# EasyEDA schematic 1-Schematic_CessnaCitationX_AP_Front.json

## Sheets
1 PCB_AP_FRONT_LEFT: TITLE: Left part of the AP font panel; REV: 1.0; Date: 2019-03-27; Sheet: 1/1; Drawn By: F-ORKI; Company: Your Company
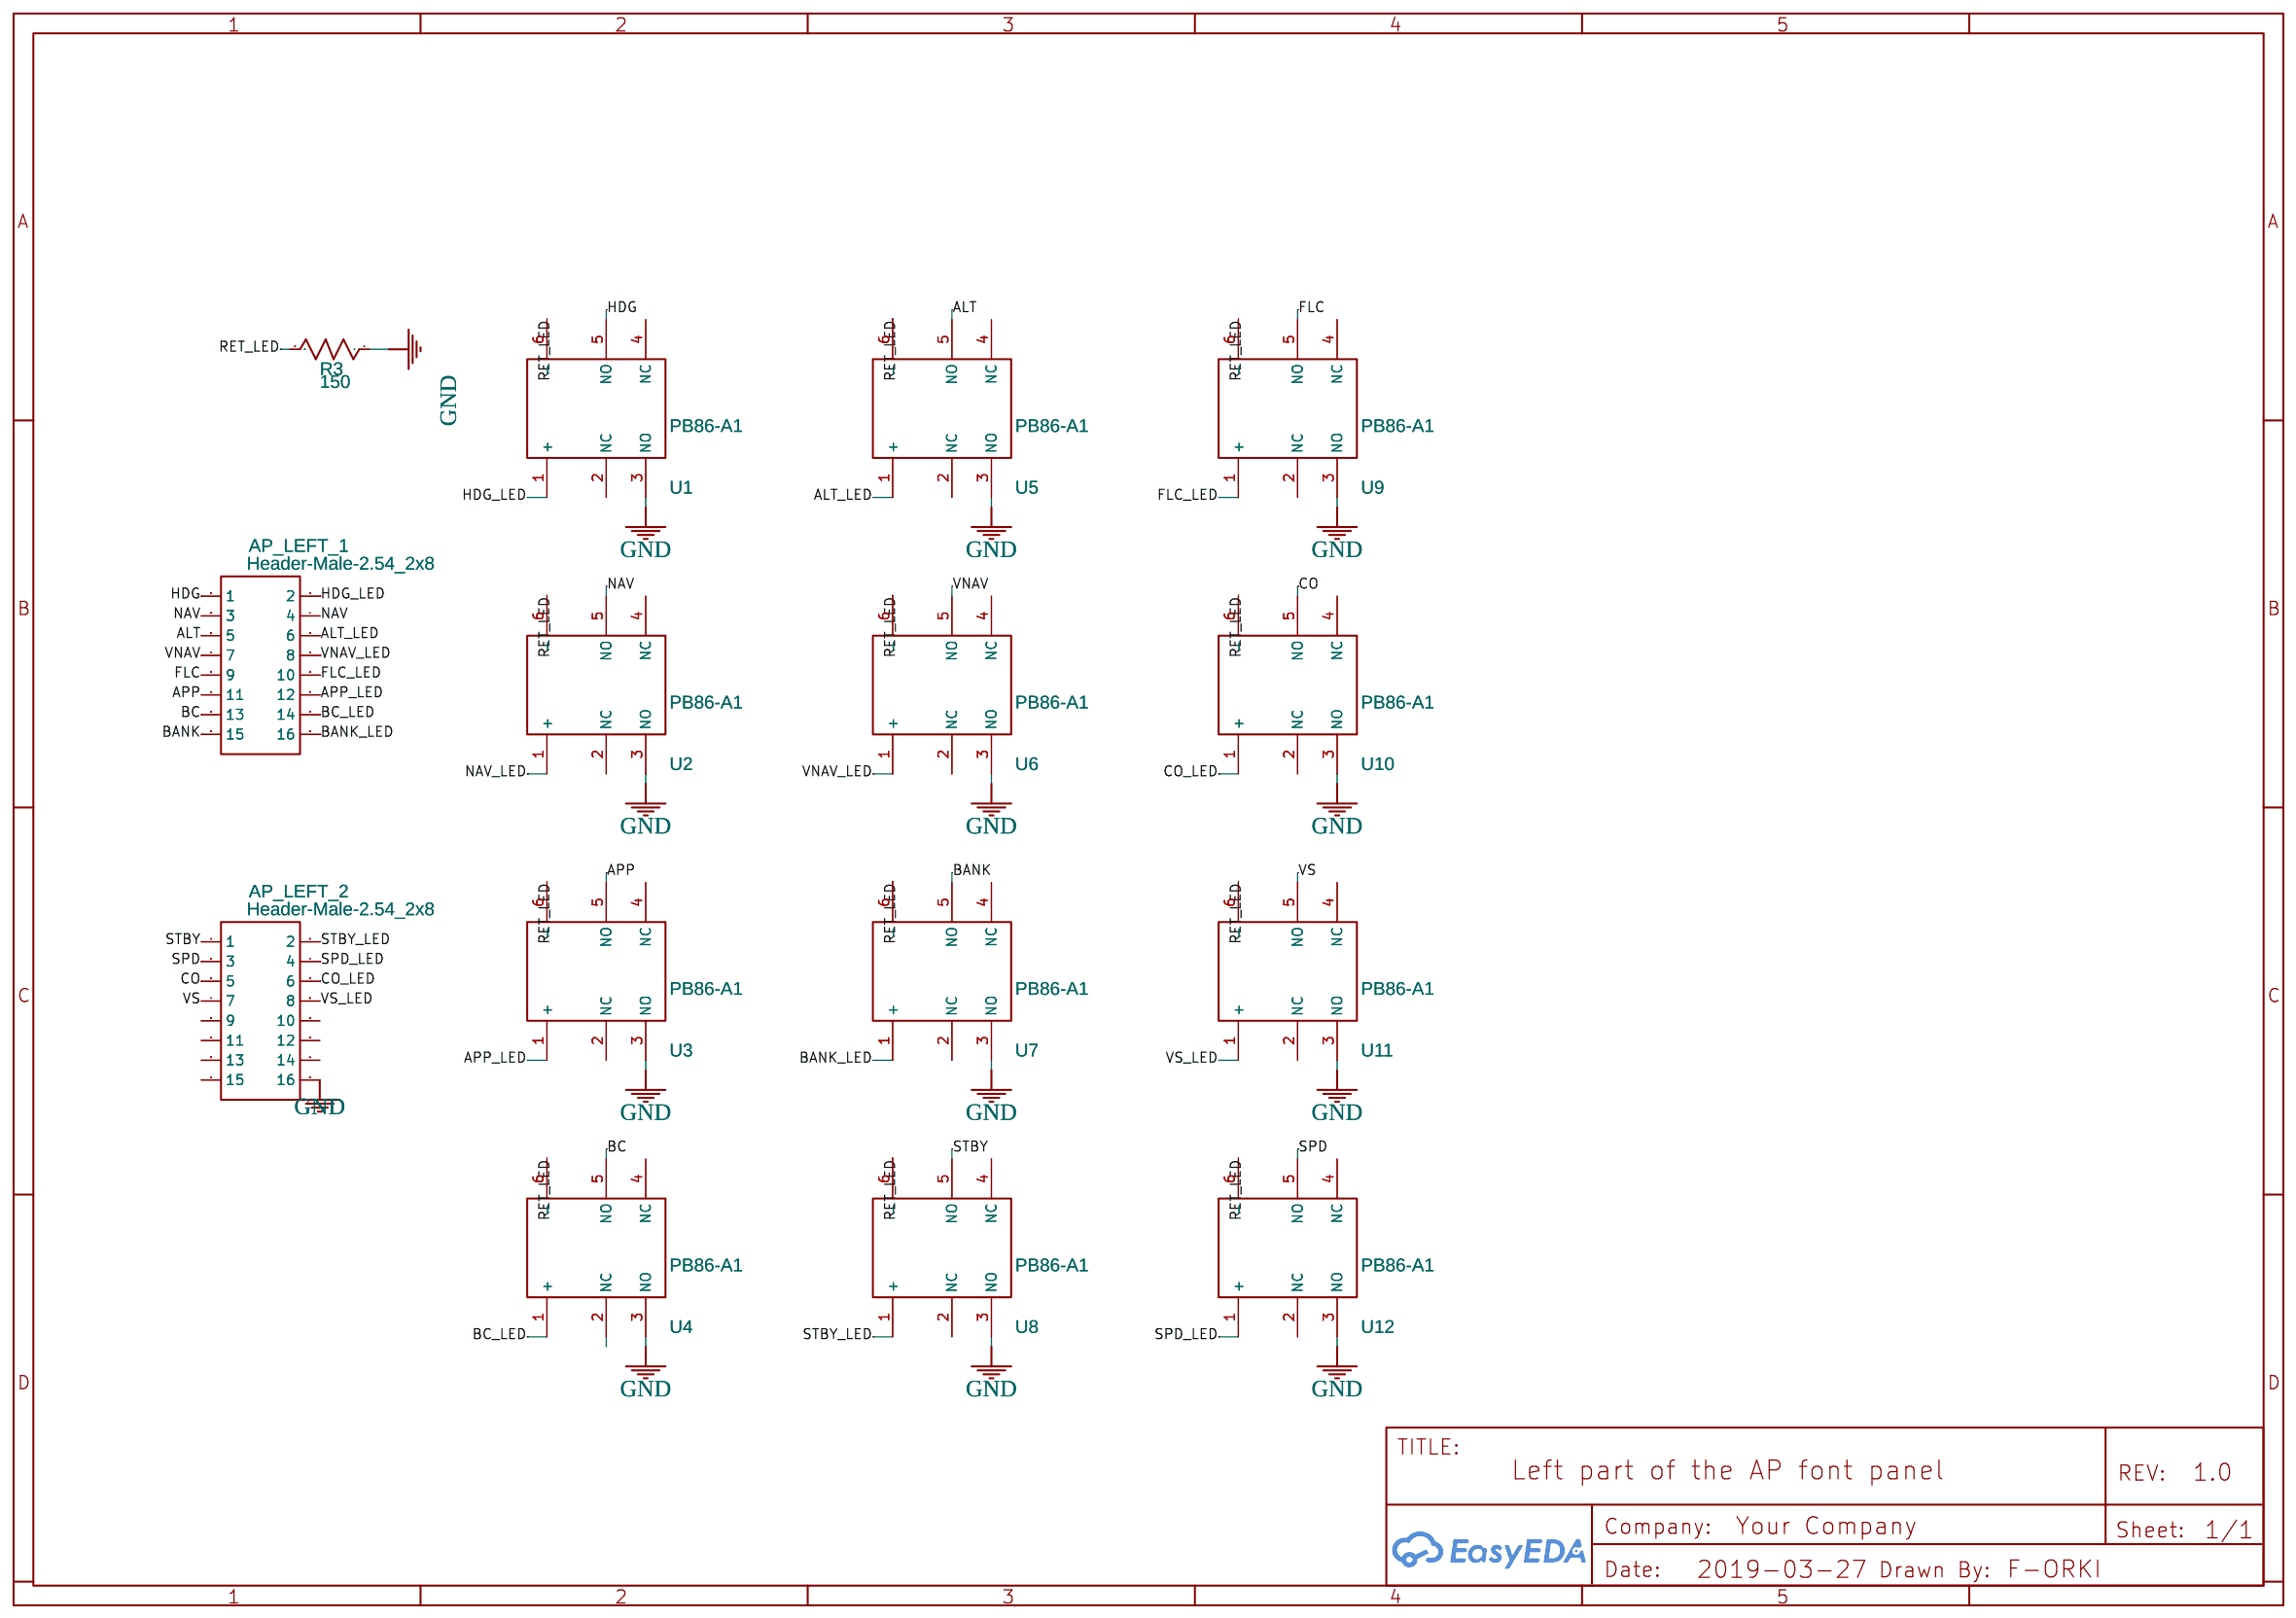
[diagram p0: PCB_AP_FRONT_LEFT]
2 PCB_AP_FRONT_RIGHT: TITLE: Right part og the AP front panel; Date: 2019-03-29; Drawn By: arnaud.dessein
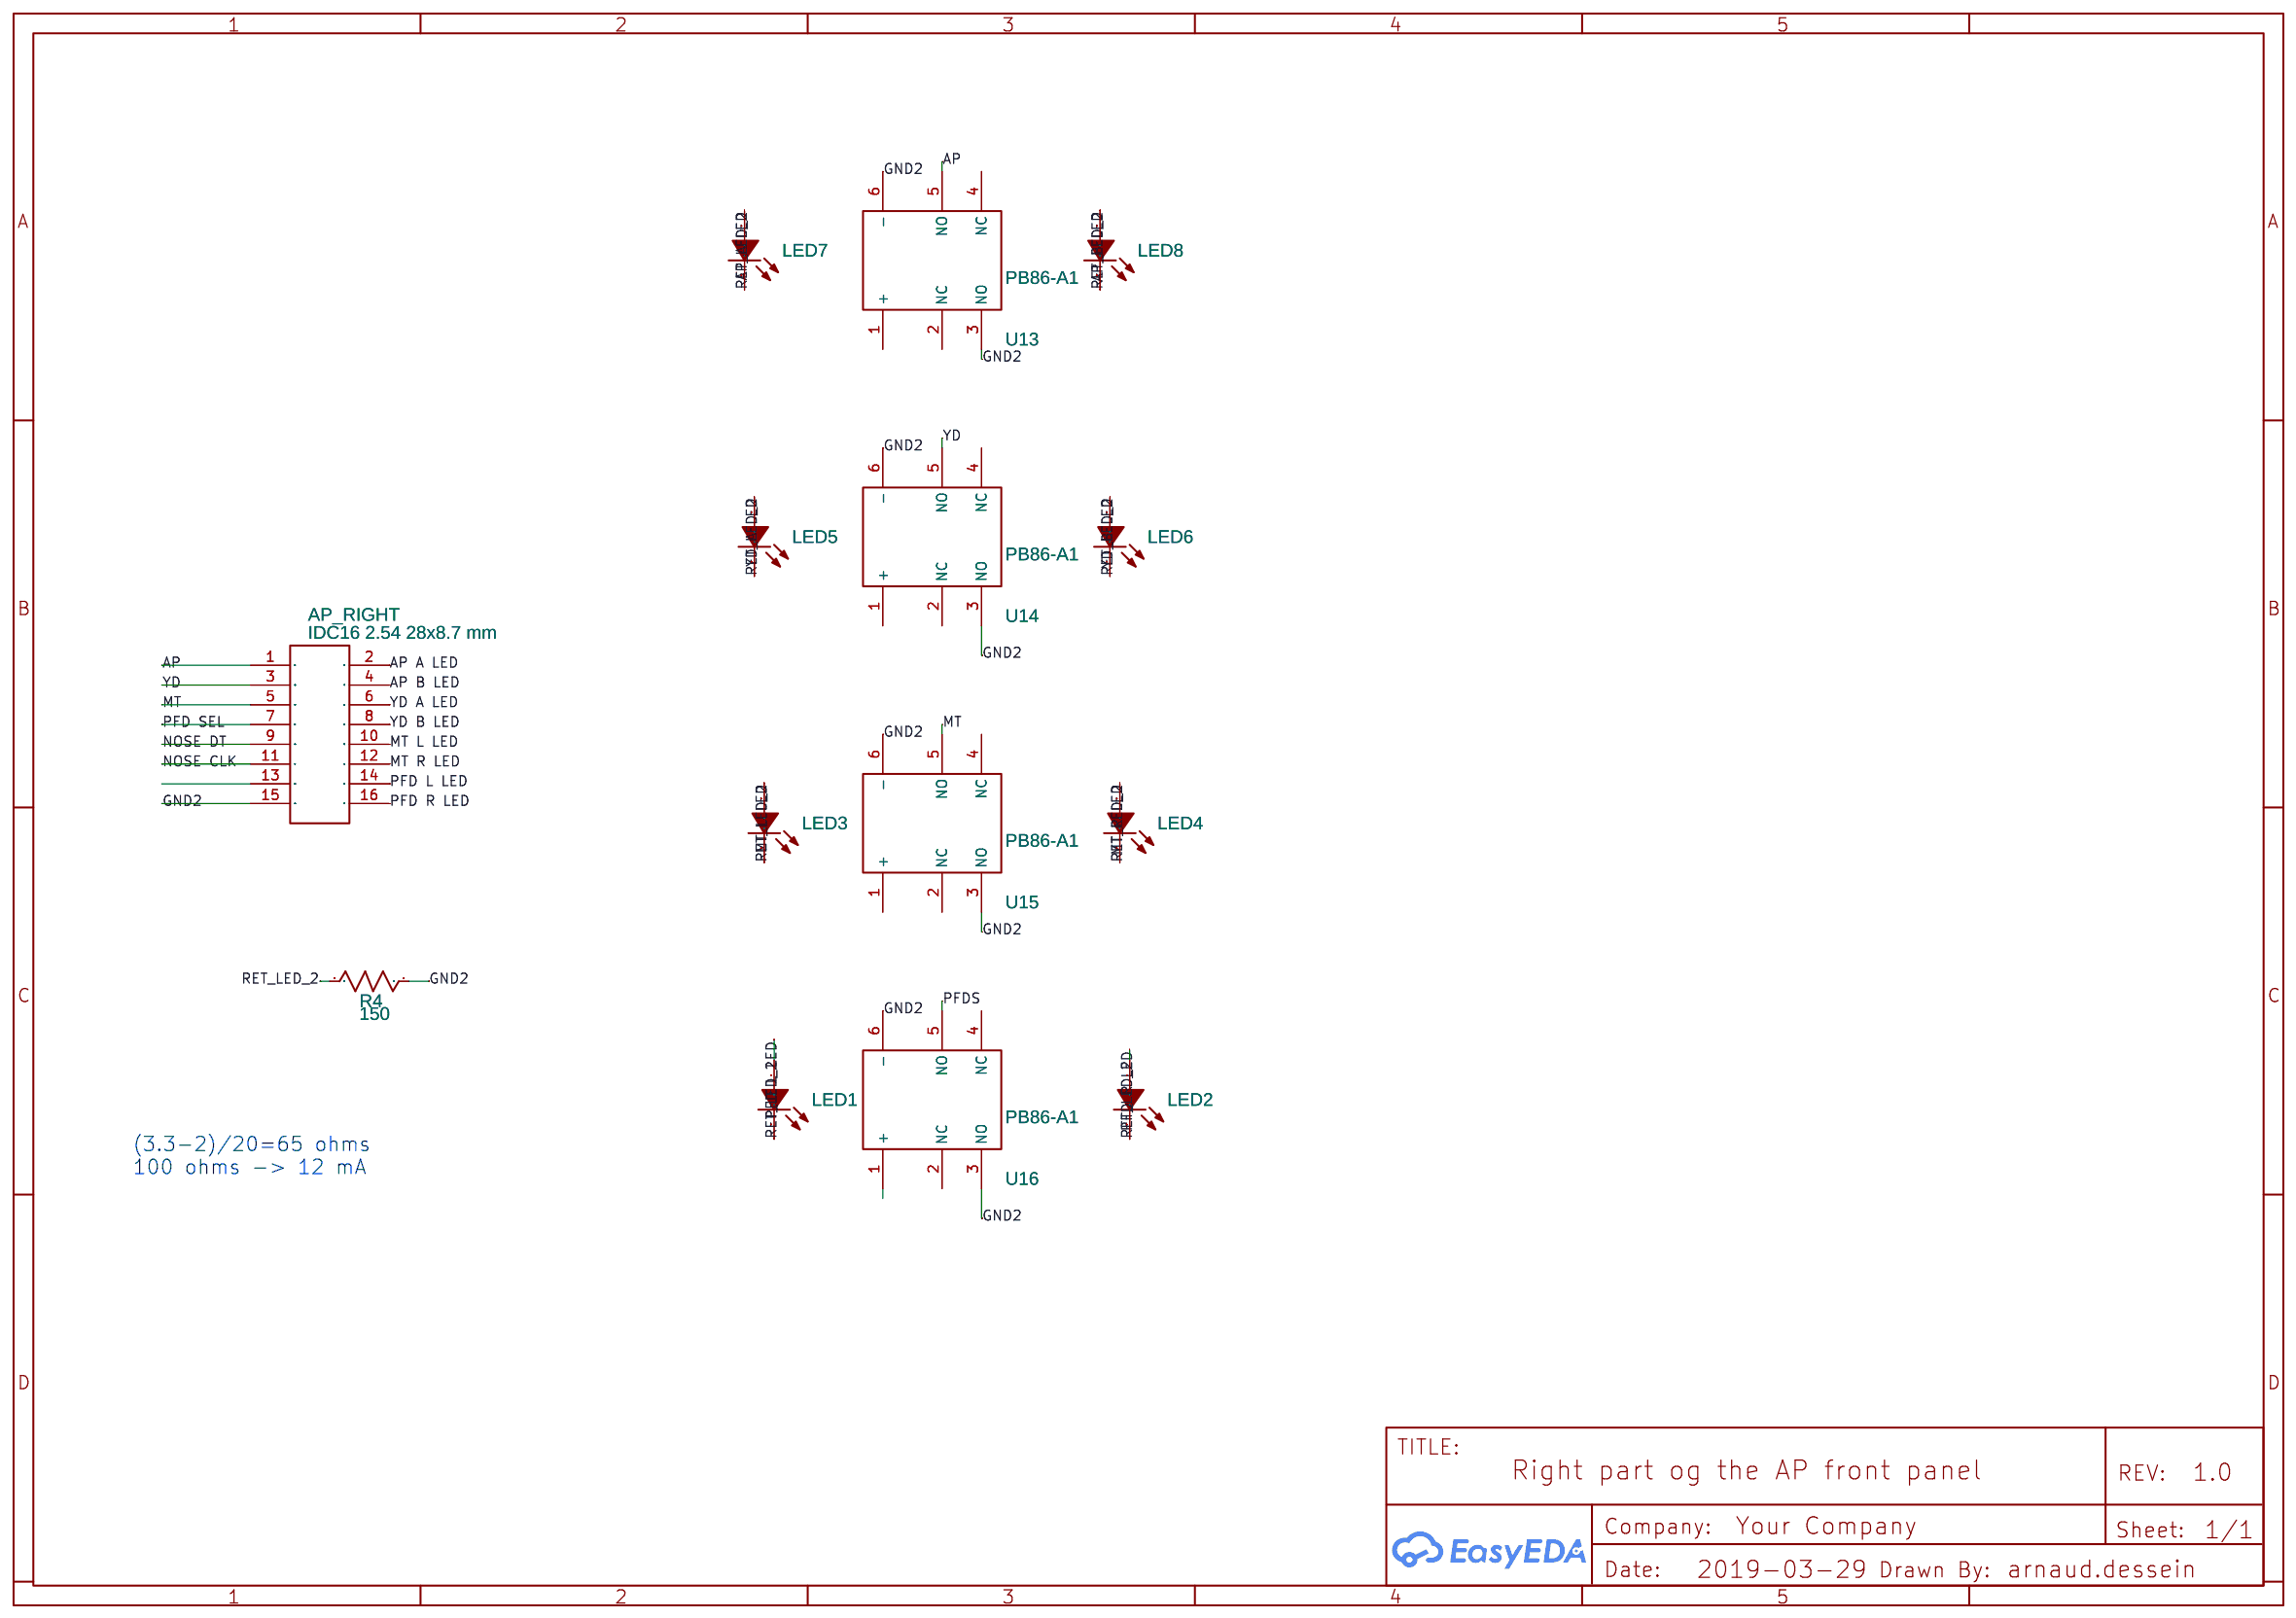
[diagram p1: PCB_AP_FRONT_RIGHT]

## Parts
sheet PCB_AP_FRONT_LEFT
AP_LEFT_1  Header-Male-2.54_2x8  [HDR-8X2/2.54]
AP_LEFT_2  Header-Male-2.54_2x8  [HDR-8X2/2.54]
R3  150  [AXIAL-0.3]
U1  PB86-A1  [PB86-A1]
U2  PB86-A1  [PB86-A1]
U3  PB86-A1  [PB86-A1]
U4  PB86-A1  [PB86-A1]
U5  PB86-A1  [PB86-A1]
U6  PB86-A1  [PB86-A1]
U7  PB86-A1  [PB86-A1]
U8  PB86-A1  [PB86-A1]
U9  PB86-A1  [PB86-A1]
U10  PB86-A1  [PB86-A1]
U11  PB86-A1  [PB86-A1]
U12  PB86-A1  [PB86-A1]
sheet PCB_AP_FRONT_RIGHT
AP_RIGHT  IDC16 2.54 28x8.7 mm  [IDC16 2.54 28X8.7 MM]
LED1  2A5Y3UD09 LED  [LED-2*5*7]
LED2  2A5Y3UD09 LED  [LED-2*5*7]
LED3  2A5Y3UD09 LED  [LED-2*5*7]
LED4  2A5Y3UD09 LED  [LED-2*5*7]
LED5  2A5Y3UD09 LED  [LED-2*5*7]
LED6  2A5Y3UD09 LED  [LED-2*5*7]
LED7  2A5Y3UD09 LED  [LED-2*5*7]
LED8  2A5Y3UD09 LED  [LED-2*5*7]
R4  150  [AXIAL-0.3]
U13  PB86-A1  [PB86-A1]
U14  PB86-A1  [PB86-A1]
U15  PB86-A1  [PB86-A1]
U16  PB86-A1  [PB86-A1]

## Library data of the parts
AP_LEFT_1 AP_LEFT_2 = -: Supplier Part: C68234; Supplier: LCSC; Manufacturer: BOOMELE; Manufacturer Part: Double row straight 2*8Headers  Pins 2.54mm; image: //image.lceda.cn/szlcsc/C68234.jpg
R3 R4 = Res_AXIAL-0.3(1/8W)_US: Manufacturer Part: ?
U1-U16 = -: link: http://product.ic114.com/IMAGE/Product/LinkImage/PB86_1.gif; Contributor: arnaud.dessein
AP_RIGHT = -: Manufacturer Part: ?; Contributor: julien.pitault.1984
LED1-LED8 = -: Supplier: LCSC; Manufacturer: KENTO; image: //image.lceda.cn/szlcsc/C3651.jpg; Supplier Part: C3651

## Nets
GND: AP_LEFT_2.16 R3.1 U1.3(NO) U2.3(NO) U3.3(NO) U4.3(NO) U5.3(NO) U6.3(NO) U7.3(NO) U8.3(NO) U9.3(NO) U10.3(NO) U11.3(NO) U12.3(NO)
GND2: AP_RIGHT.15 R4.1 U13.3(NO) U13.6(-) U14.3(NO) U14.6(-) U15.3(NO) U15.6(-) U16.3(NO) U16.6(-)
ALT: AP_LEFT_1.5 U5.5(NO)
ALT_LED: AP_LEFT_1.6 U5.1(+)
AP: AP_RIGHT.1(P1) U13.5(NO)
AP A LED: AP_RIGHT.2(P2) LED7.1(A)
AP B LED: AP_RIGHT.4(P4) LED8.1(A)
APP: AP_LEFT_1.11 U3.5(NO)
APP_LED: AP_LEFT_1.12 U3.1(+)
BANK: AP_LEFT_1.15 U7.5(NO)
BANK_LED: AP_LEFT_1.16 U7.1(+)
BC: AP_LEFT_1.13 U4.5(NO)
BC_LED: AP_LEFT_1.14 U4.1(+)
CO: AP_LEFT_2.5 U10.5(NO)
CO_LED: AP_LEFT_2.6 U10.1(+)
FLC: AP_LEFT_1.9 U9.5(NO)
FLC_LED: AP_LEFT_1.10 U9.1(+)
HDG: AP_LEFT_1.1 U1.5(NO)
HDG_LED: AP_LEFT_1.2 U1.1(+)
MT: AP_RIGHT.5(P5) U15.5(NO)
MT L LED: AP_RIGHT.10(P10) LED3.1(A)
MT R LED: AP_RIGHT.12 LED4.1(A)
NAV: AP_LEFT_1.3 AP_LEFT_1.4 U2.5(NO)
NAV_LED: U2.1(+)
NOSE CLK: AP_RIGHT.11
NOSE DT: AP_RIGHT.9(P9)
PFD L LED: AP_RIGHT.14 LED1.1(A)
PFD R LED: AP_RIGHT.16 LED2.1(A)
PFD SEL: AP_RIGHT.7(P7)
PFDS: U16.5(NO)
RET_LED: R3.2 U1.6(-) U2.6(-) U3.6(-) U4.6(-) U5.6(-) U6.6(-) U7.6(-) U8.6(-) U9.6(-) U10.6(-) U11.6(-) U12.6(-)
RET_LED_2: LED1.2(K) LED2.2(K) LED3.2(K) LED4.2(K) LED5.2(K) LED6.2(K) LED7.2(K) LED8.2(K) R4.2
SPD: AP_LEFT_2.3 U12.5(NO)
SPD_LED: AP_LEFT_2.4 U12.1(+)
STBY: AP_LEFT_2.1 U8.5(NO)
STBY_LED: AP_LEFT_2.2 U8.1(+)
VNAV: AP_LEFT_1.7 U6.5(NO)
VNAV_LED: AP_LEFT_1.8 U6.1(+)
VS: AP_LEFT_2.7 U11.5(NO)
VS_LED: AP_LEFT_2.8 U11.1(+)
YD: AP_RIGHT.3(P3) U14.5(NO)
YD A LED: AP_RIGHT.6(P6) LED5.1(A)
YD B LED: AP_RIGHT.8(P8) LED6.1(A)

Not connected (* = marked no-connect by the designer): AP_LEFT_2 9 10 11 12 13 14 15; AP_RIGHT 13; U1 2(NC) 4(NC); U2 2(NC) 4(NC); U3 2(NC) 4(NC); U4 2(NC) 4(NC); U5 2(NC) 4(NC); U6 2(NC) 4(NC); U7 2(NC) 4(NC); U8 2(NC) 4(NC); U9 2(NC) 4(NC); U10 2(NC) 4(NC); U11 2(NC) 4(NC); U12 2(NC) 4(NC); U13 1(+) 2(NC) 4(NC); U14 1(+) 2(NC) 4(NC); U15 1(+) 2(NC) 4(NC); U16 1(+) 2(NC) 4(NC)

## Notes on the sheets
sheet 2
- (3.3-2)/20=65 ohms
  100 ohms -> 12 mA
